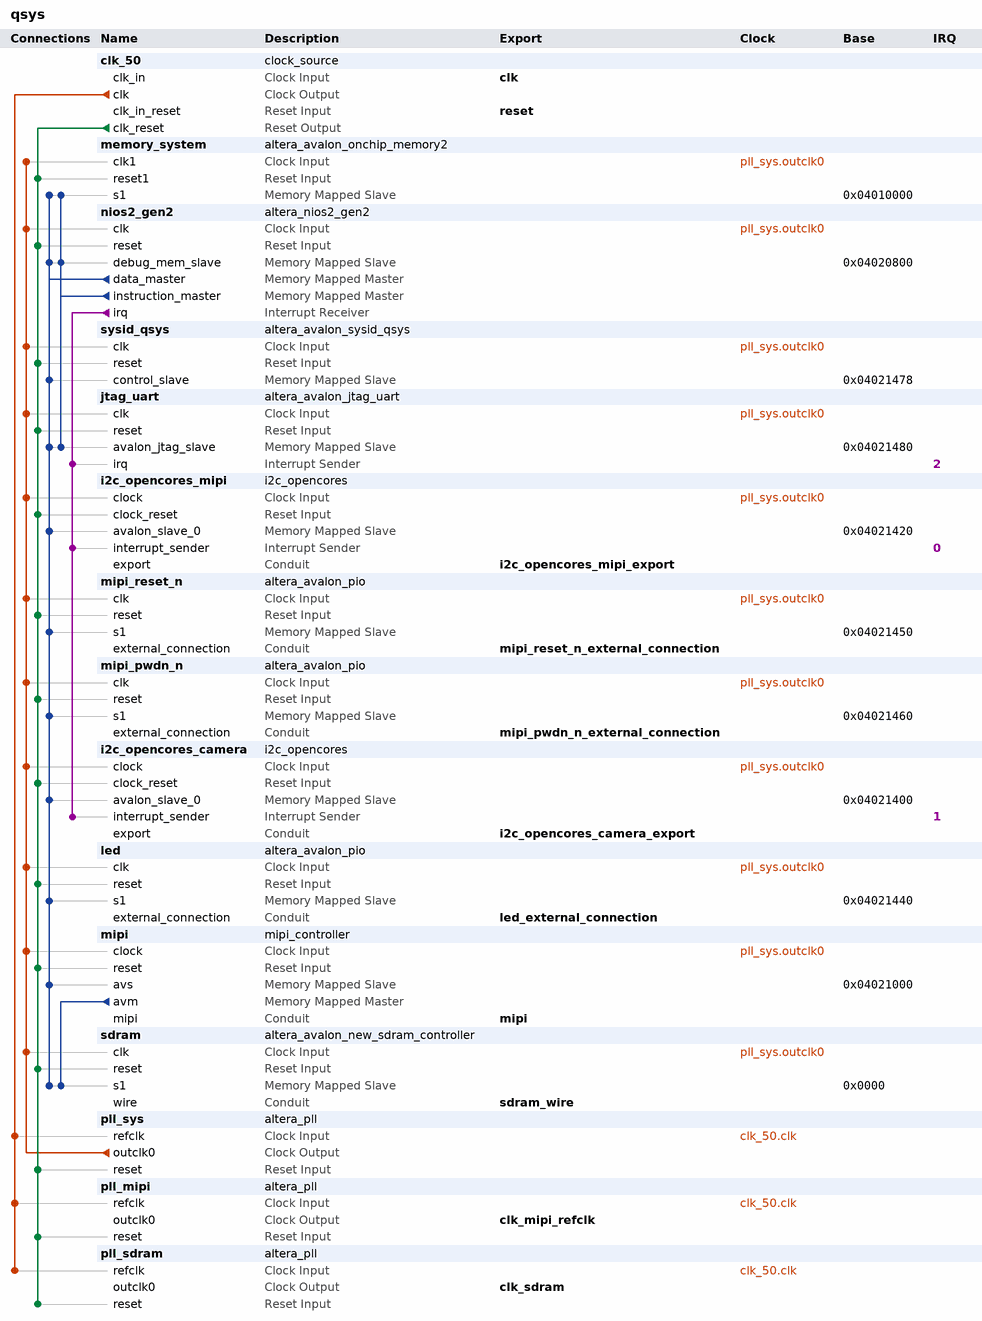
[diagram p0: system contents]
# Platform Designer (Qsys) system qsys, Cyclone V 5CSEMA5F31C6
# Parameters at their usual value, and those the tool derives, are not listed.
package require -exact qsys 18.1
create_system qsys
set_project_property DEVICE_FAMILY {Cyclone V}
set_project_property DEVICE 5CSEMA5F31C6

add_instance clk_50 clock_source 18.1
set_instance_parameter_value clk_50 clockFrequency 50000000

add_instance memory_system altera_avalon_onchip_memory2 18.1
set_instance_parameter_value memory_system dataWidth 32
set_instance_parameter_value memory_system dualPort false
set_instance_parameter_value memory_system initMemContent true
set_instance_parameter_value memory_system initializationFileName onchip_mem.hex
set_instance_parameter_value memory_system memorySize 40960

add_instance nios2_gen2 altera_nios2_gen2 18.1
set_instance_parameter_value nios2_gen2 dcache_size 2048
set_instance_parameter_value nios2_gen2 exceptionSlave memory_system.s1
set_instance_parameter_value nios2_gen2 icache_size 4096
set_instance_parameter_value nios2_gen2 impl Tiny
set_instance_parameter_value nios2_gen2 resetSlave memory_system.s1

add_instance sysid_qsys altera_avalon_sysid_qsys 18.1
set_instance_parameter_value sysid_qsys id 403708297

add_instance jtag_uart altera_avalon_jtag_uart 18.1
set_instance_parameter_value jtag_uart readBufferDepth 2048
set_instance_parameter_value jtag_uart readIRQThreshold 64
set_instance_parameter_value jtag_uart simInteractiveOptions NO_INTERACTIVE_WINDOWS
set_instance_parameter_value jtag_uart writeBufferDepth 2048
set_instance_parameter_value jtag_uart writeIRQThreshold 64

add_instance i2c_opencores_mipi i2c_opencores 12.0

add_instance mipi_reset_n altera_avalon_pio 18.1
set_instance_parameter_value mipi_reset_n direction Output
set_instance_parameter_value mipi_reset_n width 1

add_instance mipi_pwdn_n altera_avalon_pio 18.1
set_instance_parameter_value mipi_pwdn_n direction Output
set_instance_parameter_value mipi_pwdn_n width 1

add_instance i2c_opencores_camera i2c_opencores 12.0

add_instance led altera_avalon_pio 18.1
set_instance_parameter_value led direction Output
set_instance_parameter_value led width 8

add_instance mipi mipi_controller 2.5

add_instance sdram altera_avalon_new_sdram_controller 18.1
set_instance_parameter_value sdram TAC 5.4
set_instance_parameter_value sdram TRCD 15.0
set_instance_parameter_value sdram TRP 15.0
set_instance_parameter_value sdram casLatency 3
set_instance_parameter_value sdram columnWidth 10
set_instance_parameter_value sdram dataWidth 16
set_instance_parameter_value sdram generateSimulationModel false
set_instance_parameter_value sdram model single_Micron_MT48LC4M32B2_7_chip
set_instance_parameter_value sdram numberOfBanks 4
set_instance_parameter_value sdram numberOfChipSelects 1
set_instance_parameter_value sdram powerUpDelay 100.0
set_instance_parameter_value sdram refreshPeriod 7.8125
set_instance_parameter_value sdram rowWidth 13

add_instance pll_sys altera_pll 18.1
set_instance_parameter_value pll_sys gui_device_speed_grade 1
set_instance_parameter_value pll_sys gui_number_of_clocks 1
set_instance_parameter_value pll_sys gui_operation_mode normal
set_instance_parameter_value pll_sys gui_output_clock_frequency0 100.0
set_instance_parameter_value pll_sys gui_pll_mode {Integer-N PLL}
set_instance_parameter_value pll_sys gui_reference_clock_frequency 50.0
set_instance_parameter_value pll_sys gui_use_locked false

add_instance pll_mipi altera_pll 18.1
set_instance_parameter_value pll_mipi gui_device_speed_grade 1
set_instance_parameter_value pll_mipi gui_number_of_clocks 1
set_instance_parameter_value pll_mipi gui_operation_mode normal
set_instance_parameter_value pll_mipi gui_output_clock_frequency0 20.0
set_instance_parameter_value pll_mipi gui_pll_mode {Integer-N PLL}
set_instance_parameter_value pll_mipi gui_ps_units0 degrees
set_instance_parameter_value pll_mipi gui_reference_clock_frequency 50.0
set_instance_parameter_value pll_mipi gui_use_locked false

add_instance pll_sdram altera_pll 18.1
set_instance_parameter_value pll_sdram gui_device_speed_grade 1
set_instance_parameter_value pll_sdram gui_number_of_clocks 1
set_instance_parameter_value pll_sdram gui_operation_mode normal
set_instance_parameter_value pll_sdram gui_output_clock_frequency0 143.0
set_instance_parameter_value pll_sdram gui_phase_shift0 -3758
set_instance_parameter_value pll_sdram gui_pll_mode {Integer-N PLL}
set_instance_parameter_value pll_sdram gui_reference_clock_frequency 50.0
set_instance_parameter_value pll_sdram gui_use_locked false

# connections
add_connection clk_50.clk pll_mipi.refclk clock
add_connection clk_50.clk pll_sdram.refclk clock
add_connection clk_50.clk pll_sys.refclk clock
add_connection pll_sys.outclk0 i2c_opencores_camera.clock clock
add_connection pll_sys.outclk0 i2c_opencores_mipi.clock clock
add_connection pll_sys.outclk0 jtag_uart.clk clock
add_connection pll_sys.outclk0 led.clk clock
add_connection pll_sys.outclk0 memory_system.clk1 clock
add_connection pll_sys.outclk0 mipi.clock clock
add_connection pll_sys.outclk0 mipi_pwdn_n.clk clock
add_connection pll_sys.outclk0 mipi_reset_n.clk clock
add_connection pll_sys.outclk0 nios2_gen2.clk clock
add_connection pll_sys.outclk0 sdram.clk clock
add_connection pll_sys.outclk0 sysid_qsys.clk clock
add_connection clk_50.clk_reset i2c_opencores_camera.clock_reset reset
add_connection clk_50.clk_reset i2c_opencores_mipi.clock_reset reset
add_connection clk_50.clk_reset jtag_uart.reset reset
add_connection clk_50.clk_reset led.reset reset
add_connection clk_50.clk_reset memory_system.reset1 reset
add_connection clk_50.clk_reset mipi.reset reset
add_connection clk_50.clk_reset mipi_pwdn_n.reset reset
add_connection clk_50.clk_reset mipi_reset_n.reset reset
add_connection clk_50.clk_reset nios2_gen2.reset reset
add_connection clk_50.clk_reset pll_mipi.reset reset
add_connection clk_50.clk_reset pll_sdram.reset reset
add_connection clk_50.clk_reset pll_sys.reset reset
add_connection clk_50.clk_reset sdram.reset reset
add_connection clk_50.clk_reset sysid_qsys.reset reset
add_connection mipi.avm sdram.s1 avalon
set_connection_parameter_value mipi.avm/sdram.s1 baseAddress 0x0000
add_connection nios2_gen2.data_master i2c_opencores_camera.avalon_slave_0 avalon
set_connection_parameter_value nios2_gen2.data_master/i2c_opencores_camera.avalon_slave_0 baseAddress 0x04021400
add_connection nios2_gen2.data_master i2c_opencores_mipi.avalon_slave_0 avalon
set_connection_parameter_value nios2_gen2.data_master/i2c_opencores_mipi.avalon_slave_0 baseAddress 0x04021420
add_connection nios2_gen2.data_master jtag_uart.avalon_jtag_slave avalon
set_connection_parameter_value nios2_gen2.data_master/jtag_uart.avalon_jtag_slave baseAddress 0x04021480
add_connection nios2_gen2.data_master led.s1 avalon
set_connection_parameter_value nios2_gen2.data_master/led.s1 baseAddress 0x04021440
add_connection nios2_gen2.data_master memory_system.s1 avalon
set_connection_parameter_value nios2_gen2.data_master/memory_system.s1 baseAddress 0x04010000
add_connection nios2_gen2.data_master mipi.avs avalon
set_connection_parameter_value nios2_gen2.data_master/mipi.avs baseAddress 0x04021000
add_connection nios2_gen2.data_master mipi_pwdn_n.s1 avalon
set_connection_parameter_value nios2_gen2.data_master/mipi_pwdn_n.s1 baseAddress 0x04021460
add_connection nios2_gen2.data_master mipi_reset_n.s1 avalon
set_connection_parameter_value nios2_gen2.data_master/mipi_reset_n.s1 baseAddress 0x04021450
add_connection nios2_gen2.data_master nios2_gen2.debug_mem_slave avalon
set_connection_parameter_value nios2_gen2.data_master/nios2_gen2.debug_mem_slave baseAddress 0x04020800
add_connection nios2_gen2.data_master sdram.s1 avalon
set_connection_parameter_value nios2_gen2.data_master/sdram.s1 baseAddress 0x0000
add_connection nios2_gen2.data_master sysid_qsys.control_slave avalon
set_connection_parameter_value nios2_gen2.data_master/sysid_qsys.control_slave baseAddress 0x04021478
add_connection nios2_gen2.instruction_master jtag_uart.avalon_jtag_slave avalon
set_connection_parameter_value nios2_gen2.instruction_master/jtag_uart.avalon_jtag_slave baseAddress 0x04021480
add_connection nios2_gen2.instruction_master memory_system.s1 avalon
set_connection_parameter_value nios2_gen2.instruction_master/memory_system.s1 baseAddress 0x04010000
add_connection nios2_gen2.instruction_master nios2_gen2.debug_mem_slave avalon
set_connection_parameter_value nios2_gen2.instruction_master/nios2_gen2.debug_mem_slave baseAddress 0x04020800
add_connection nios2_gen2.irq i2c_opencores_camera.interrupt_sender interrupt
set_connection_parameter_value nios2_gen2.irq/i2c_opencores_camera.interrupt_sender irqNumber 1
add_connection nios2_gen2.irq i2c_opencores_mipi.interrupt_sender interrupt
set_connection_parameter_value nios2_gen2.irq/i2c_opencores_mipi.interrupt_sender irqNumber 0
add_connection nios2_gen2.irq jtag_uart.irq interrupt
set_connection_parameter_value nios2_gen2.irq/jtag_uart.irq irqNumber 2

# exported interfaces
add_interface clk clock sink
set_interface_property clk EXPORT_OF clk_50.clk_in
add_interface clk_mipi_refclk clock source
set_interface_property clk_mipi_refclk EXPORT_OF pll_mipi.outclk0
add_interface clk_sdram clock source
set_interface_property clk_sdram EXPORT_OF pll_sdram.outclk0
add_interface i2c_opencores_camera_export conduit end
set_interface_property i2c_opencores_camera_export EXPORT_OF i2c_opencores_camera.export
add_interface i2c_opencores_mipi_export conduit end
set_interface_property i2c_opencores_mipi_export EXPORT_OF i2c_opencores_mipi.export
add_interface led_external_connection conduit end
set_interface_property led_external_connection EXPORT_OF led.external_connection
add_interface mipi conduit end
set_interface_property mipi EXPORT_OF mipi.mipi
add_interface mipi_pwdn_n_external_connection conduit end
set_interface_property mipi_pwdn_n_external_connection EXPORT_OF mipi_pwdn_n.external_connection
add_interface mipi_reset_n_external_connection conduit end
set_interface_property mipi_reset_n_external_connection EXPORT_OF mipi_reset_n.external_connection
add_interface reset reset sink
set_interface_property reset EXPORT_OF clk_50.clk_in_reset
add_interface sdram_wire conduit end
set_interface_property sdram_wire EXPORT_OF sdram.wire

set_interconnect_requirement {$system} qsys_mm.clockCrossingAdapter AUTO
set_interconnect_requirement {$system} qsys_mm.enableEccProtection FALSE
set_interconnect_requirement {$system} qsys_mm.insertDefaultSlave FALSE
set_interconnect_requirement {$system} qsys_mm.maxAdditionalLatency 0

save_system qsys.qsys
